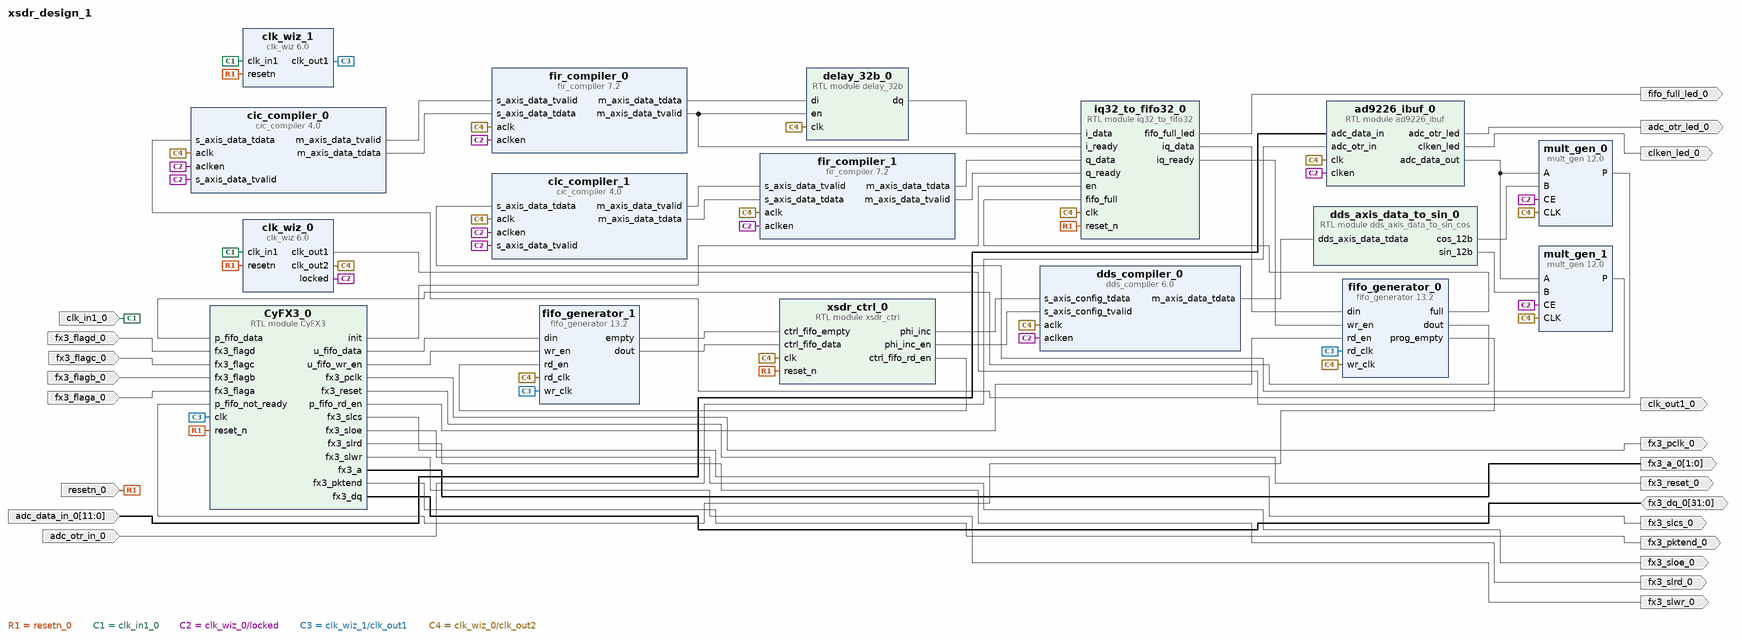
[diagram p0: block diagram of the top level]
# Vivado block design xsdr_design_1, xc7a35tftg256-1, Vivado 2018.3
create_bd_design xsdr_design_1

create_bd_port -dir I -type rst resetn_0
create_bd_port -dir I -type clk clk_in1_0
set_property -dict {CONFIG.FREQ_HZ 50000000} [get_bd_ports clk_in1_0]
create_bd_port -dir O -type clk clk_out1_0
set_property -dict {CONFIG.FREQ_HZ 64000000} [get_bd_ports clk_out1_0]
create_bd_port -dir I -from 11 -to 0 adc_data_in_0
create_bd_port -dir I adc_otr_in_0
create_bd_port -dir O clken_led_0
create_bd_port -dir O adc_otr_led_0
create_bd_port -dir O fifo_full_led_0
create_bd_port -dir O fx3_pclk_0
create_bd_port -dir O -type rst fx3_reset_0
create_bd_port -dir O fx3_slcs_0
create_bd_port -dir O fx3_sloe_0
create_bd_port -dir O fx3_slrd_0
create_bd_port -dir O fx3_slwr_0
create_bd_port -dir O fx3_pktend_0
create_bd_port -dir O -from 1 -to 0 fx3_a_0
create_bd_port -dir IO -from 31 -to 0 fx3_dq_0
create_bd_port -dir I fx3_flagd_0
create_bd_port -dir I fx3_flagc_0
create_bd_port -dir I fx3_flagb_0
create_bd_port -dir I fx3_flaga_0

create_bd_cell -type ip -vlnv xilinx.com:ip:clk_wiz:6.0 clk_wiz_0
set_property -dict [list \
  CONFIG.CLKIN1_JITTER_PS 200.0 \
  CONFIG.CLKOUT1_DRIVES BUFG \
  CONFIG.CLKOUT1_JITTER 651.823 \
  CONFIG.CLKOUT1_PHASE_ERROR 919.522 \
  CONFIG.CLKOUT1_REQUESTED_OUT_FREQ 64 \
  CONFIG.CLKOUT2_DRIVES BUFG \
  CONFIG.CLKOUT2_JITTER 651.823 \
  CONFIG.CLKOUT2_PHASE_ERROR 919.522 \
  CONFIG.CLKOUT2_REQUESTED_OUT_FREQ 64 \
  CONFIG.CLKOUT2_REQUESTED_PHASE 90 \
  CONFIG.CLKOUT2_USED true \
  CONFIG.CLKOUT3_DRIVES BUFG \
  CONFIG.CLKOUT4_DRIVES BUFG \
  CONFIG.CLKOUT5_DRIVES BUFG \
  CONFIG.CLKOUT6_DRIVES BUFG \
  CONFIG.CLKOUT7_DRIVES BUFG \
  CONFIG.FEEDBACK_SOURCE FDBK_AUTO \
  CONFIG.MMCM_CLKFBOUT_MULT_F 64.000 \
  CONFIG.MMCM_CLKIN1_PERIOD 20.000 \
  CONFIG.MMCM_CLKIN2_PERIOD 10.0 \
  CONFIG.MMCM_CLKOUT0_DIVIDE_F 10.000 \
  CONFIG.MMCM_CLKOUT1_DIVIDE 10 \
  CONFIG.MMCM_CLKOUT1_PHASE 90.000 \
  CONFIG.MMCM_DIVCLK_DIVIDE 5 \
  CONFIG.NUM_OUT_CLKS 2 \
  CONFIG.PRIM_IN_FREQ 50 \
  CONFIG.PRIM_SOURCE No_buffer \
  CONFIG.RESET_PORT resetn \
  CONFIG.RESET_TYPE ACTIVE_LOW \
  CONFIG.USE_SAFE_CLOCK_STARTUP false \
] [get_bd_cells clk_wiz_0]
create_bd_cell -type ip -vlnv xilinx.com:ip:dds_compiler:6.0 dds_compiler_0
set_property -dict [list \
  CONFIG.DATA_Has_TLAST Not_Required \
  CONFIG.DDS_Clock_Rate 64 \
  CONFIG.DSP48_Use Minimal \
  CONFIG.Frequency_Resolution 0.4 \
  CONFIG.Has_ACLKEN true \
  CONFIG.Has_Phase_Out false \
  CONFIG.Latency 4 \
  CONFIG.M_DATA_Has_TUSER Not_Required \
  CONFIG.Noise_Shaping Phase_Dithering \
  CONFIG.Output_Frequency1 0 \
  CONFIG.Output_Width 12 \
  CONFIG.PINC1 000111000110011001100111 \
  CONFIG.Parameter_Entry Hardware_Parameters \
  CONFIG.Phase_Increment Programmable \
  CONFIG.Phase_Width 24 \
  CONFIG.S_PHASE_Has_TUSER Not_Required \
] [get_bd_cells dds_compiler_0]
create_bd_cell -type ip -vlnv xilinx.com:ip:mult_gen:12.0 mult_gen_0
set_property -dict [list \
  CONFIG.ClockEnable true \
  CONFIG.MultType Parallel_Multiplier \
  CONFIG.PortAType Signed \
  CONFIG.PortAWidth 12 \
  CONFIG.PortBType Signed \
  CONFIG.PortBWidth 12 \
] [get_bd_cells mult_gen_0]
create_bd_cell -type ip -vlnv xilinx.com:ip:mult_gen:12.0 mult_gen_1
set_property -dict [list \
  CONFIG.ClockEnable true \
  CONFIG.PortAType Signed \
  CONFIG.PortAWidth 12 \
  CONFIG.PortBType Signed \
  CONFIG.PortBWidth 12 \
] [get_bd_cells mult_gen_1]
create_bd_cell -type ip -vlnv xilinx.com:ip:cic_compiler:4.0 cic_compiler_0
set_property -dict [list \
  CONFIG.Clock_Frequency 64 \
  CONFIG.Differential_Delay 2 \
  CONFIG.Filter_Type Decimation \
  CONFIG.Fixed_Or_Initial_Rate 16 \
  CONFIG.HAS_ACLKEN true \
  CONFIG.Input_Data_Width 24 \
  CONFIG.Input_Sample_Frequency 64 \
  CONFIG.Maximum_Rate 16 \
  CONFIG.Minimum_Rate 16 \
  CONFIG.Number_Of_Stages 5 \
  CONFIG.Output_Data_Width 28 \
  CONFIG.Quantization Truncation \
  CONFIG.SamplePeriod 1 \
  CONFIG.Use_Xtreme_DSP_Slice false \
] [get_bd_cells cic_compiler_0]
create_bd_cell -type ip -vlnv xilinx.com:ip:cic_compiler:4.0 cic_compiler_1
set_property -dict [list \
  CONFIG.Clock_Frequency 64 \
  CONFIG.Differential_Delay 2 \
  CONFIG.Filter_Type Decimation \
  CONFIG.Fixed_Or_Initial_Rate 16 \
  CONFIG.HAS_ACLKEN true \
  CONFIG.Input_Data_Width 24 \
  CONFIG.Input_Sample_Frequency 64 \
  CONFIG.Maximum_Rate 16 \
  CONFIG.Minimum_Rate 16 \
  CONFIG.Number_Of_Stages 5 \
  CONFIG.Output_Data_Width 28 \
  CONFIG.Quantization Truncation \
  CONFIG.SamplePeriod 1 \
  CONFIG.Use_Xtreme_DSP_Slice false \
] [get_bd_cells cic_compiler_1]
create_bd_cell -type module -reference ad9226_ibuf ad9226_ibuf_0
create_bd_cell -type ip -vlnv xilinx.com:ip:fir_compiler:7.2 fir_compiler_0
set_property -dict [list \
  CONFIG.Clock_Frequency 64 \
  CONFIG.CoefficientVector -609,-452,681,642,-889,-1010,1213,1605,-1641,-2498,2128,3752,-2631,-5452,3069,7684,-3347,-10573,3306,14268,-2719,-19001,1174,25094,2090,-33029,-8718,43319,22642,-55368,-54508,57903,131070,57903,-54508,-55368,22642,43319,-8718,-33029,2090,25094,1174,-19001,-2719,14268,3306,-10573,-3347,7684,3069,-5452,-2631,3752,2128,-2498,-1641,1605,1213,-1010,-889,642,681,-452,-609 \
  CONFIG.Coefficient_Fractional_Bits 0 \
  CONFIG.Coefficient_Sets 1 \
  CONFIG.Coefficient_Sign Signed \
  CONFIG.Coefficient_Structure Inferred \
  CONFIG.Coefficient_Width 18 \
  CONFIG.ColumnConfig 2 \
  CONFIG.Data_Fractional_Bits 0 \
  CONFIG.Data_Sign Signed \
  CONFIG.Data_Width 28 \
  CONFIG.Decimation_Rate 2 \
  CONFIG.Filter_Architecture Systolic_Multiply_Accumulate \
  CONFIG.Filter_Type Decimation \
  CONFIG.Has_ACLKEN true \
  CONFIG.Interpolation_Rate 1 \
  CONFIG.Number_Channels 1 \
  CONFIG.Output_Rounding_Mode Truncate_LSBs \
  CONFIG.Output_Width 32 \
  CONFIG.Quantization Integer_Coefficients \
  CONFIG.RateSpecification Frequency_Specification \
  CONFIG.Sample_Frequency 4 \
  CONFIG.Zero_Pack_Factor 1 \
] [get_bd_cells fir_compiler_0]
create_bd_cell -type ip -vlnv xilinx.com:ip:fir_compiler:7.2 fir_compiler_1
set_property -dict [list \
  CONFIG.Clock_Frequency 64 \
  CONFIG.CoefficientVector -609,-452,681,642,-889,-1010,1213,1605,-1641,-2498,2128,3752,-2631,-5452,3069,7684,-3347,-10573,3306,14268,-2719,-19001,1174,25094,2090,-33029,-8718,43319,22642,-55368,-54508,57903,131070,57903,-54508,-55368,22642,43319,-8718,-33029,2090,25094,1174,-19001,-2719,14268,3306,-10573,-3347,7684,3069,-5452,-2631,3752,2128,-2498,-1641,1605,1213,-1010,-889,642,681,-452,-609 \
  CONFIG.Coefficient_Fractional_Bits 0 \
  CONFIG.Coefficient_Sets 1 \
  CONFIG.Coefficient_Sign Signed \
  CONFIG.Coefficient_Structure Inferred \
  CONFIG.Coefficient_Width 18 \
  CONFIG.ColumnConfig 2 \
  CONFIG.Data_Fractional_Bits 0 \
  CONFIG.Data_Sign Signed \
  CONFIG.Data_Width 28 \
  CONFIG.Decimation_Rate 2 \
  CONFIG.Filter_Architecture Systolic_Multiply_Accumulate \
  CONFIG.Filter_Type Decimation \
  CONFIG.Has_ACLKEN true \
  CONFIG.Interpolation_Rate 1 \
  CONFIG.Number_Channels 1 \
  CONFIG.Output_Rounding_Mode Truncate_LSBs \
  CONFIG.Output_Width 32 \
  CONFIG.Quantization Integer_Coefficients \
  CONFIG.RateSpecification Frequency_Specification \
  CONFIG.Sample_Frequency 4 \
  CONFIG.Zero_Pack_Factor 1 \
] [get_bd_cells fir_compiler_1]
create_bd_cell -type ip -vlnv xilinx.com:ip:fifo_generator:13.2 fifo_generator_0
set_property -dict [list \
  CONFIG.Empty_Threshold_Assert_Value 8192 \
  CONFIG.Fifo_Implementation Independent_Clocks_Block_RAM \
  CONFIG.Input_Data_Width 32 \
  CONFIG.Input_Depth 16384 \
  CONFIG.Output_Data_Width 32 \
  CONFIG.Performance_Options Standard_FIFO \
  CONFIG.Programmable_Empty_Type Single_Programmable_Empty_Threshold_Constant \
  CONFIG.Reset_Pin false \
] [get_bd_cells fifo_generator_0]
create_bd_cell -type ip -vlnv xilinx.com:ip:clk_wiz:6.0 clk_wiz_1
set_property -dict [list \
  CONFIG.CLKIN1_JITTER_PS 200.0 \
  CONFIG.CLKOUT1_JITTER 162.035 \
  CONFIG.CLKOUT1_PHASE_ERROR 164.985 \
  CONFIG.MMCM_CLKFBOUT_MULT_F 20.000 \
  CONFIG.MMCM_CLKIN1_PERIOD 20.000 \
  CONFIG.MMCM_CLKIN2_PERIOD 10.0 \
  CONFIG.MMCM_DIVCLK_DIVIDE 1 \
  CONFIG.PRIM_IN_FREQ 50 \
  CONFIG.PRIM_SOURCE No_buffer \
  CONFIG.RESET_PORT resetn \
  CONFIG.RESET_TYPE ACTIVE_LOW \
] [get_bd_cells clk_wiz_1]
create_bd_cell -type module -reference delay_32b delay_32b_0
create_bd_cell -type module -reference dds_axis_data_to_sin_cos dds_axis_data_to_sin_0
create_bd_cell -type module -reference iq32_to_fifo32 iq32_to_fifo32_0
create_bd_cell -type ip -vlnv xilinx.com:ip:fifo_generator:13.2 fifo_generator_1
set_property -dict [list \
  CONFIG.Fifo_Implementation Independent_Clocks_Block_RAM \
  CONFIG.INTERFACE_TYPE Native \
  CONFIG.Input_Data_Width 32 \
  CONFIG.Input_Depth 64 \
  CONFIG.Output_Data_Width 32 \
  CONFIG.Reset_Pin false \
] [get_bd_cells fifo_generator_1]
create_bd_cell -type module -reference xsdr_ctrl xsdr_ctrl_0
create_bd_cell -type module -reference CyFX3 CyFX3_0

# ---- connections ----

connect_bd_net -net resetn_0_1 [get_bd_ports resetn_0] \
  [get_bd_pins clk_wiz_0/resetn] [get_bd_pins clk_wiz_1/resetn] [get_bd_pins iq32_to_fifo32_0/reset_n] \
  [get_bd_pins xsdr_ctrl_0/reset_n] [get_bd_pins CyFX3_0/reset_n]
connect_bd_net -net clk_in1_0_1 [get_bd_ports clk_in1_0] [get_bd_pins clk_wiz_0/clk_in1] [get_bd_pins clk_wiz_1/clk_in1]
connect_bd_net [get_bd_pins clk_wiz_0/clk_out1] [get_bd_ports clk_out1_0]
connect_bd_net -net adc_data_in_0_1 [get_bd_ports adc_data_in_0] [get_bd_pins ad9226_ibuf_0/adc_data_in]
connect_bd_net [get_bd_pins clk_wiz_0/locked] \
  [get_bd_pins dds_compiler_0/aclken] [get_bd_pins mult_gen_1/CE] [get_bd_pins mult_gen_0/CE] \
  [get_bd_pins cic_compiler_1/aclken] [get_bd_pins cic_compiler_0/aclken] [get_bd_pins cic_compiler_1/s_axis_data_tvalid] \
  [get_bd_pins cic_compiler_0/s_axis_data_tvalid] [get_bd_pins ad9226_ibuf_0/clken] [get_bd_pins fir_compiler_1/aclken] \
  [get_bd_pins fir_compiler_0/aclken]
connect_bd_net [get_bd_pins mult_gen_0/P] [get_bd_pins cic_compiler_0/s_axis_data_tdata]
connect_bd_net [get_bd_pins mult_gen_1/P] [get_bd_pins cic_compiler_1/s_axis_data_tdata]
connect_bd_net -net adc_otr_in_0_1 [get_bd_ports adc_otr_in_0] [get_bd_pins ad9226_ibuf_0/adc_otr_in]
connect_bd_net [get_bd_pins ad9226_ibuf_0/clken_led] [get_bd_ports clken_led_0]
connect_bd_net [get_bd_pins ad9226_ibuf_0/adc_otr_led] [get_bd_ports adc_otr_led_0]
connect_bd_net [get_bd_pins cic_compiler_0/m_axis_data_tvalid] [get_bd_pins fir_compiler_0/s_axis_data_tvalid]
connect_bd_net [get_bd_pins cic_compiler_1/m_axis_data_tvalid] [get_bd_pins fir_compiler_1/s_axis_data_tvalid]
connect_bd_net [get_bd_pins iq32_to_fifo32_0/fifo_full_led] [get_bd_ports fifo_full_led_0]
connect_bd_net [get_bd_pins fifo_generator_0/full] [get_bd_pins iq32_to_fifo32_0/fifo_full]
connect_bd_net [get_bd_pins iq32_to_fifo32_0/iq_data] [get_bd_pins fifo_generator_0/din]
connect_bd_net [get_bd_pins iq32_to_fifo32_0/iq_ready] [get_bd_pins fifo_generator_0/wr_en]
connect_bd_net [get_bd_pins clk_wiz_1/clk_out1] [get_bd_pins fifo_generator_0/rd_clk] [get_bd_pins fifo_generator_1/wr_clk] [get_bd_pins CyFX3_0/clk]
connect_bd_net [get_bd_pins CyFX3_0/init] [get_bd_pins iq32_to_fifo32_0/en]
connect_bd_net [get_bd_pins CyFX3_0/fx3_pclk] [get_bd_ports fx3_pclk_0]
connect_bd_net [get_bd_pins CyFX3_0/fx3_reset] [get_bd_ports fx3_reset_0]
connect_bd_net [get_bd_pins CyFX3_0/fx3_slcs] [get_bd_ports fx3_slcs_0]
connect_bd_net [get_bd_pins CyFX3_0/fx3_sloe] [get_bd_ports fx3_sloe_0]
connect_bd_net [get_bd_pins CyFX3_0/fx3_slrd] [get_bd_ports fx3_slrd_0]
connect_bd_net [get_bd_pins CyFX3_0/fx3_slwr] [get_bd_ports fx3_slwr_0]
connect_bd_net [get_bd_pins CyFX3_0/fx3_pktend] [get_bd_ports fx3_pktend_0]
connect_bd_net [get_bd_pins CyFX3_0/fx3_a] [get_bd_ports fx3_a_0]
connect_bd_net [get_bd_ports fx3_dq_0] [get_bd_pins CyFX3_0/fx3_dq]
connect_bd_net -net fx3_flagd_0_1 [get_bd_ports fx3_flagd_0] [get_bd_pins CyFX3_0/fx3_flagd]
connect_bd_net -net fx3_flagc_0_1 [get_bd_ports fx3_flagc_0] [get_bd_pins CyFX3_0/fx3_flagc]
connect_bd_net -net fx3_flagb_0_1 [get_bd_ports fx3_flagb_0] [get_bd_pins CyFX3_0/fx3_flagb]
connect_bd_net -net fx3_flaga_0_1 [get_bd_ports fx3_flaga_0] [get_bd_pins CyFX3_0/fx3_flaga]
connect_bd_net [get_bd_pins fir_compiler_0/m_axis_data_tdata] [get_bd_pins delay_32b_0/di]
connect_bd_net [get_bd_pins fir_compiler_0/m_axis_data_tvalid] [get_bd_pins delay_32b_0/en] [get_bd_pins iq32_to_fifo32_0/i_ready]
connect_bd_net [get_bd_pins delay_32b_0/dq] [get_bd_pins iq32_to_fifo32_0/i_data]
connect_bd_net [get_bd_pins fir_compiler_1/m_axis_data_tdata] [get_bd_pins iq32_to_fifo32_0/q_data]
connect_bd_net [get_bd_pins fir_compiler_1/m_axis_data_tvalid] [get_bd_pins iq32_to_fifo32_0/q_ready]
connect_bd_net [get_bd_pins ad9226_ibuf_0/adc_data_out] [get_bd_pins mult_gen_0/A] [get_bd_pins mult_gen_1/A]
connect_bd_net [get_bd_pins dds_compiler_0/m_axis_data_tdata] [get_bd_pins dds_axis_data_to_sin_0/dds_axis_data_tdata]
connect_bd_net [get_bd_pins dds_axis_data_to_sin_0/cos_12b] [get_bd_pins mult_gen_0/B]
connect_bd_net [get_bd_pins dds_axis_data_to_sin_0/sin_12b] [get_bd_pins mult_gen_1/B]
connect_bd_net [get_bd_pins CyFX3_0/p_fifo_rd_en] [get_bd_pins fifo_generator_0/rd_en]
connect_bd_net [get_bd_pins fifo_generator_0/dout] [get_bd_pins CyFX3_0/p_fifo_data]
connect_bd_net [get_bd_pins fifo_generator_0/prog_empty] [get_bd_pins CyFX3_0/p_fifo_not_ready]
connect_bd_net [get_bd_pins CyFX3_0/u_fifo_data] [get_bd_pins fifo_generator_1/din]
connect_bd_net [get_bd_pins CyFX3_0/u_fifo_wr_en] [get_bd_pins fifo_generator_1/wr_en]
connect_bd_net [get_bd_pins fifo_generator_1/empty] [get_bd_pins xsdr_ctrl_0/ctrl_fifo_empty]
connect_bd_net [get_bd_pins fifo_generator_1/dout] [get_bd_pins xsdr_ctrl_0/ctrl_fifo_data]
connect_bd_net [get_bd_pins xsdr_ctrl_0/ctrl_fifo_rd_en] [get_bd_pins fifo_generator_1/rd_en]
connect_bd_net [get_bd_pins xsdr_ctrl_0/phi_inc] [get_bd_pins dds_compiler_0/s_axis_config_tdata]
connect_bd_net [get_bd_pins xsdr_ctrl_0/phi_inc_en] [get_bd_pins dds_compiler_0/s_axis_config_tvalid]
connect_bd_net [get_bd_pins clk_wiz_0/clk_out2] \
  [get_bd_pins dds_compiler_0/aclk] [get_bd_pins mult_gen_0/CLK] [get_bd_pins mult_gen_1/CLK] \
  [get_bd_pins cic_compiler_1/aclk] [get_bd_pins cic_compiler_0/aclk] [get_bd_pins ad9226_ibuf_0/clk] \
  [get_bd_pins fir_compiler_1/aclk] [get_bd_pins fir_compiler_0/aclk] [get_bd_pins fifo_generator_0/wr_clk] \
  [get_bd_pins delay_32b_0/clk] [get_bd_pins iq32_to_fifo32_0/clk] [get_bd_pins fifo_generator_1/rd_clk] \
  [get_bd_pins xsdr_ctrl_0/clk]
connect_bd_net [get_bd_pins cic_compiler_0/m_axis_data_tdata] [get_bd_pins fir_compiler_0/s_axis_data_tdata]
connect_bd_net [get_bd_pins cic_compiler_1/m_axis_data_tdata] [get_bd_pins fir_compiler_1/s_axis_data_tdata]

validate_bd_design
save_bd_design
